# Altium schematic sheet heater.SchDoc
size A
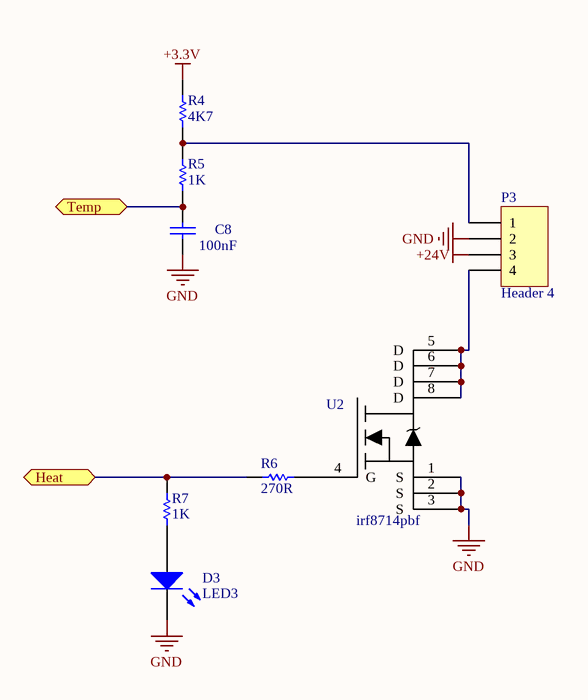
[diagram p0: heater.SchDoc]

## Parts
C8  value 100nF  [1608[0603]]  (hidden comment: Cap)
D3  LED3  [LED 0805]
P3  Header 4  [HDR1X4]
R4  value 4K7  [J1-0603]  (hidden comment: Res)
R5  value 1K  [J1-0603]  (hidden comment: Res)
R6  value 270R  [J1-0603]  (hidden comment: Res)
R7  value 1K  [J1-0603]  (hidden comment: Res)
U2  irf8714pbf  [SO-8_M]

## Ports
Heat, Temp

## Nets
+3.3V: R4.2
+24V: P3.3
GND: C8.2 D3.2(K) P3.2 U2.1(S) U2.2(S) U2.3(S)
Heat: R6.2 R7.2 ; port Heat
Temp: C8.1 R5.1 ; port Temp
NetD3_1: D3.1(A) R7.1
NetP3_1: P3.1 R4.1 R5.2
NetP3_4: P3.4 U2.5(D) U2.6(D) U2.7(D) U2.8(D)
NetR6_1: R6.1 U2.4(G)

## Library data of the parts
C8 = Cap: Capacitor; Published: 8-Jun-2000; LatestRevisionDate: 17-Jul-2002; LatestRevisionNote: Re-released for DXP Platform.; PackageReference: RAD-0.3; Publisher: Altium Limited; PackageDescription: Radial Cap, Thru-Hole; 2 Leads; 0.3 in Pin Spacing
D3 = LED3: Typical BLUE SiC LED; Published: 8-Jun-2000; LatestRevisionDate: 17-Dec-2003; LatestRevisionNote: PCB Footprint replaced.; DatasheetVersion: 16-Apr-2002; PackageVersion: 16-Apr-2002; PackageReference: 3.5X2.8X1.9; Publisher: Altium Limited; PackageDescription: SM LED; 2 C-Bend Leads; Body 3.5 x 2.8 x 1.9 mm, inc leads (LxWxH typ)
P3 = Header 4: Header, 4-Pin; LatestRevisionDate: 17-Jul-2002; LatestRevisionNote: Re-released for DXP Platform.; Publisher: Altium Limited
R4-R7 = Res: Resistor 0805; Published: 8-Jun-2000; LatestRevisionDate: 17-Jul-2002; LatestRevisionNote: Re-released for DXP Platform.; PackageReference: AXIAL-0.3; Publisher: Altium Limited; PackageDescription: Axial Device, Thru-Hole; 2 Leads; 0.3 in Pin Spacing